# EAGLE board AtoVproject 16n ALPS V1.4 NL (EAGLE 9.5.2)
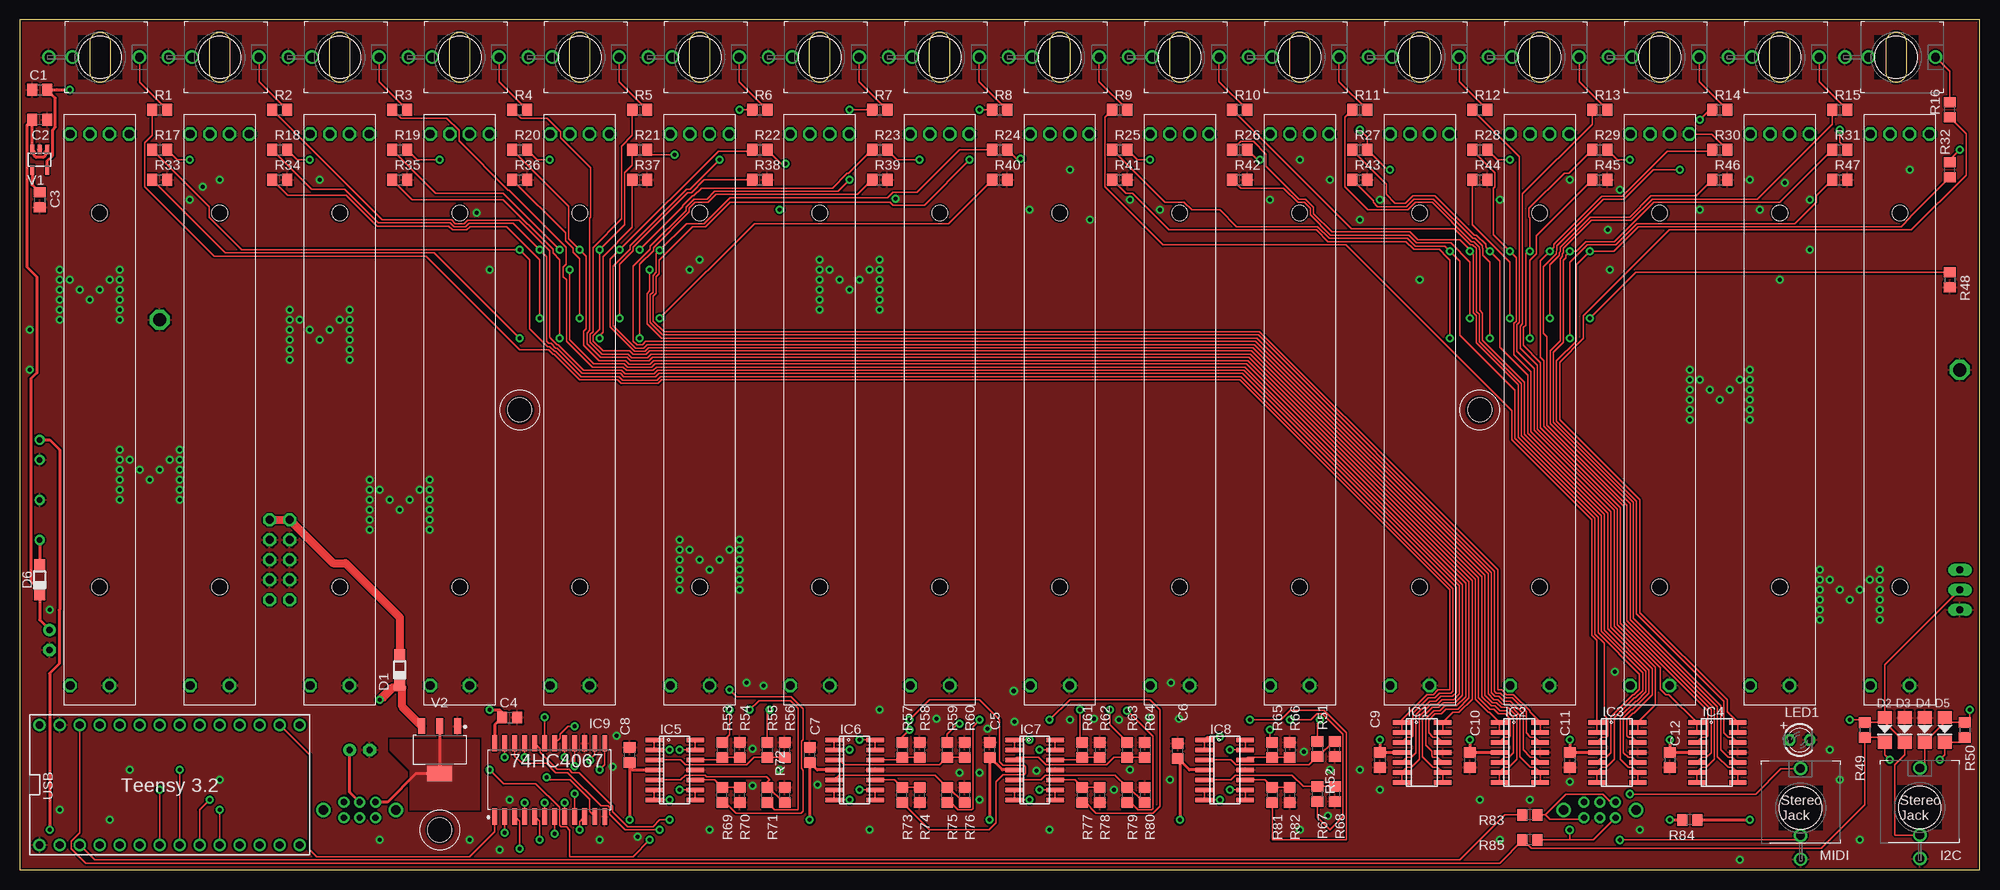
[diagram p2: board, top side]
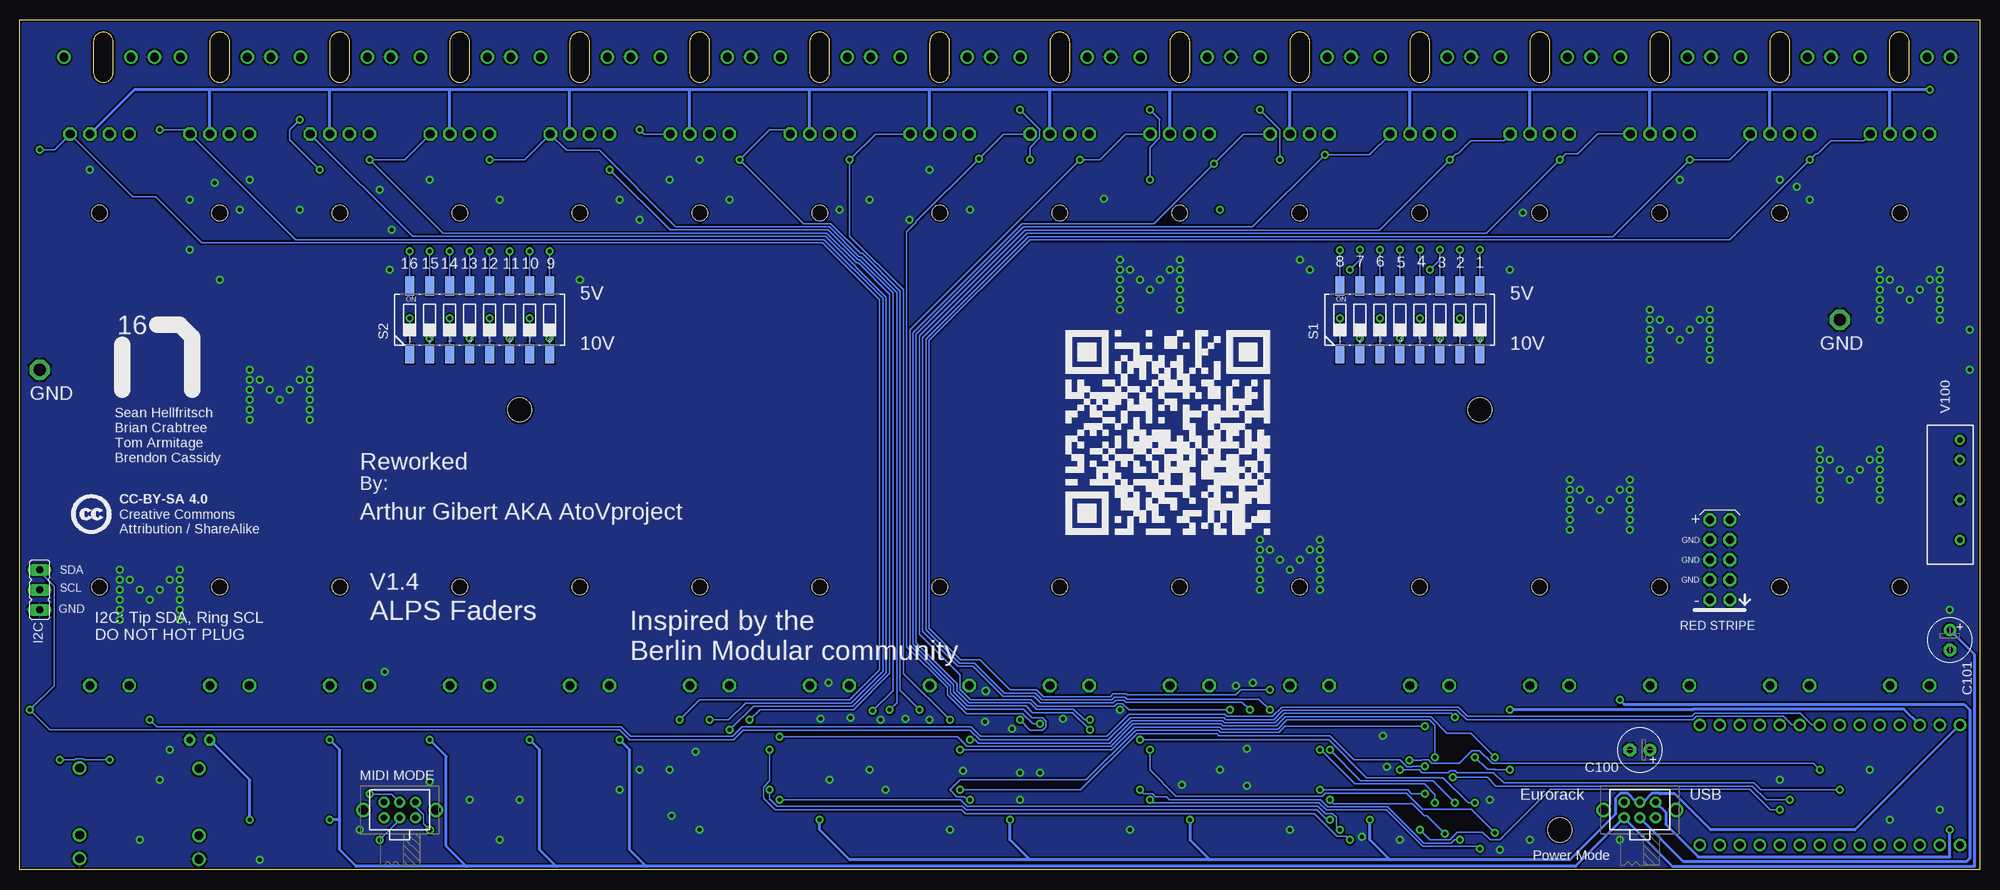
[diagram p3: board, bottom side, seen from below]

Size 248.92 x 107.95 mm. Coordinates in mm from the lower left corner, seen from the top.
Outline: 0,107.95 0,0 248.92,0 248.92,107.95 0,107.95
Copper layers (1*16): Top 0.035mm / dielectric 1.5mm / Bottom 0.035mm
Design rules "SparkFun": minimum track width 8mil, minimum drill 20mil, track to track 8mil, track to pad 8mil, pad to pad 8mil, via to via 8mil, smd to smd 8mil, copper to edge 10mil, drill to drill 8mil, minimum pad ring 12mil, minimum via ring 10mil, stop-mask expansion 4mil, vias tented up to drill 25mil, thermal gap 10mil
Holes 3.1 mm at 63.5,58.42 185.42,58.42 53.34,5.08

## Footprints (pad centres in the part's own frame; a part is rotated, then mirrored left to right if it is on the bottom)
C0805 = smd 1.3 x 1.5: 1 -0.95,0; 2 0.95,0
E2,5-6 = drill 0.813 pad 1.6: + -1.27,0 | drill 0.813 pad 1.6 octagon: - 1.27,0
SOD123 = smd 1.4 x 1.4: A 1.9,0; C -1.9,0
SOD-123 = smd 1.6 x 1.8: A 1.575,0; C -1.575,0
P1-17 = drill 1.702 pad 2.54 octagon: TP 0,0
JP2 = drill 0.914 long: 1 -2.54,0; 2 0,0; 3 2.54,0
SO14 = smd 0.6 x 2.2: 1 -3.81,-2.6; 2 -2.54,-2.6; 3 -1.27,-2.6; 4 0,-2.6; 5 1.27,-2.6; 6 2.54,-2.6; 7 3.81,-2.6; 8 3.81,2.6; 9 2.54,2.6; 10 1.27,2.6; 11 0,2.6; 12 -1.27,2.6; 13 -2.54,2.6; 14 -3.81,2.6
SOIC127P1030X265-24 = smd 2.056 x 0.602: 1 -4.642,6.985; 2 -4.642,5.715; 3 -4.642,4.445; 4 -4.642,3.175; 5 -4.642,1.905; 6 -4.642,0.635; 7 -4.642,-0.635; 8 -4.642,-1.905; 9 -4.642,-3.175; 10 -4.642,-4.445; 11 -4.642,-5.715; 12 -4.642,-6.985; 13 4.642,-6.985; 14 4.642,-5.715; 15 4.642,-4.445; 16 4.642,-3.175; 17 4.642,-1.905; 18 4.642,-0.635; 19 4.642,0.635; 20 4.642,1.905; 21 4.642,3.175; 22 4.642,4.445; 23 4.642,5.715; 24 4.642,6.985
TEENSY_3_AND_LC_SERIES_BOARDS_V1.4_TEENSY_3.0-3.2&LC_DIL = drill 0.965: 0 -7.62,13.97; 1 -7.62,11.43; 2 -7.62,8.89; 3 -7.62,6.35; 3.3V 7.62,11.43; 4 -7.62,3.81; 5 -7.62,1.27; 6 -7.62,-1.27; 7 -7.62,-3.81; 8 -7.62,-6.35; 9 -7.62,-8.89; 10 -7.62,-11.43; 11 -7.62,-13.97; 12 -7.62,-16.51; 13 7.62,-16.51; 14/A0 7.62,-13.97; 15/A1 7.62,-11.43; 16/A2 7.62,-8.89; 17/A3 7.62,-6.35; 18/A4 7.62,-3.81; 19/A5 7.62,-1.27; 20/A6 7.62,1.27; 21/A7 7.62,3.81; 22/A8 7.62,6.35; 23/A9 7.62,8.89; AGND 7.62,13.97; GND -7.62,16.51; VIN 7.62,16.51
WQP-PJ301M-12JACK-BANANA = drill 1.1: P$1_TIP 0,5; P$2_SWITCH 0,-3.5; P$3_SLEEVE 0,-6.5
WQP-PJ366ST_JACK = drill 1.1: P$1_TIP 0,5; P$2_SWITCH 0,-3.5; P$3_SLEEVE 0,-6.5
LED3MM = drill 0.813 octagon: A -1.27,0; K 1.27,0
R0805 = smd 1.3 x 1.5: 1 -0.95,0; 2 0.95,0
CTS-219-08 = smd 1.13 x 2.44: 1 -8.89,-4.3; 2 -6.35,-4.3; 3 -3.81,-4.3; 4 -1.27,-4.3; 5 1.27,-4.3; 6 3.81,-4.3; 7 6.35,-4.3; 8 8.89,-4.3; 9 8.89,4.3; 10 6.35,4.3; 11 3.81,4.3; 12 1.27,4.3; 13 -1.27,4.3; 14 -3.81,4.3; 15 -6.35,4.3; 16 -8.89,4.3
EG2211 = drill 0.8: P1 -1,0; P1-TA -1,2; P1-TB -1,-2; P2 1,0; P2-TA 1,2; P2-TB 1,-2 | drill 1.2: P$7 0,4.6; P$8 0,-4.6
EURO_POWER_HEADER = drill 1.016 octagon: 1 -5.08,-1.27; 2 -5.08,1.27; 3 -2.54,-1.27; 4 -2.54,1.27; 5 0,-1.27; 6 0,1.27; 7 2.54,-1.27; 8 2.54,1.27; 9 5.08,-1.27; 10 5.08,1.27
MONOME_RS6011SP600 = drill 1.1 octagon: 1 -35,1.25; 2 -35,3.75; 3 35,1.25; L1 35,-3.75; L2 -35,-3.75; L3 -35,-1.25 | hole 2: -25,0; 22.5,0
SOT23-5 = smd 0.55 x 1.2: 1 -0.95,-1.3; 2 0,-1.3; 3 0.95,-1.3; 4 0.95,1.3; 5 -0.95,1.3
SOT223 = smd 1.965 x 0.889: GND -3.023,2.3; IN -3.023,-2.3; OUT -3.023,0 | smd 1.965 x 3.189: TAB 3.023,0
TMA = drill 0.7 pad 1.1: 1 -3.81,0; 2 -1.27,0; 3 3.81,0; 4 8.89,0

## Placement (x,y rotation side)
C1  10u  [C0805]  2.54,99.06 0 top
C2  1u  [C0805]  2.54,95.25 180 top
C3  10n  [C0805]  2.54,85.09 270 top
C4  100n  [C0805]  62.23,19.37 0 top
C5  100n  [C0805]  123.19,15.24 90 top
C6  100n  [C0805]  147.06,15.12 90 top
C7  100n  [C0805]  100.33,14.61 90 top
C8  100n  [C0805]  77.47,14.6 90 top
C9  100n  [C0805]  172.72,13.97 270 top
C10  100n  [C0805]  184.15,13.97 270 top
C11  100n  [C0805]  196.85,13.97 270 top
C12  100n  [C0805]  209.55,13.97 270 top
C100  47uf  [E2,5-6]  43.18,15.24 180 bottom
C101  47uf  [E2,5-6]  3.81,29.21 270 bottom
D1  [SOD123]  48.26,25.4 90 top
D2  [SOD-123]  236.86,17.78 90 top
D3  [SOD-123]  239.4,17.78 90 top
D4  [SOD-123]  241.94,17.78 90 top
D5  [SOD-123]  244.48,17.78 90 top
D6  [SOD123]  2.54,36.83 90 top
GND  TPPAD1-17  [P1-17]  17.78,69.85 0 bottom
I2C  [JP2]  246.38,35.56 270 bottom
IC1  NCS2007  [SO14]  178.12,14.92 270 top
IC2  NCS2007  [SO14]  190.5,14.92 270 top
IC3  NCS2007  [SO14]  202.88,14.92 270 top
IC4  NCS2007  [SO14]  215.58,14.92 270 top
IC5  MCP6004_SMD  [SO14]  83.19,12.7 270 top
IC6  MCP6004_SMD  [SO14]  106.05,12.7 270 top
IC7  MCP6004_SMD  [SO14]  128.91,12.7 270 top
IC8  MCP6004_SMD  [SO14]  153.04,12.7 270 top
IC9  CD74HC4067SM96  [SOIC127P1030X265-24]  67.31,11.43 90 top
IC10  TEENSY_3.2_PIN  [TEENSY_3_AND_LC_SERIES_BOARDS_V1.4_TEENSY_3.0-3.2&LC_DIL]  19.05,10.79 90 top
J1  THONKICONN  [WQP-PJ301M-12JACK-BANANA]  10.22,103.19 270 top
J2  THONKICONN  [WQP-PJ301M-12JACK-BANANA]  25.4,103.19 270 top
J3  THONKICONN  [WQP-PJ301M-12JACK-BANANA]  40.64,103.19 270 top
J4  THONKICONN  [WQP-PJ301M-12JACK-BANANA]  55.88,103.19 270 top
J5  THONKICONN  [WQP-PJ301M-12JACK-BANANA]  71.12,103.19 270 top
J6  THONKICONN  [WQP-PJ301M-12JACK-BANANA]  86.36,103.19 270 top
J7  THONKICONN  [WQP-PJ301M-12JACK-BANANA]  101.6,103.19 270 top
J8  THONKICONN  [WQP-PJ301M-12JACK-BANANA]  116.84,103.19 270 top
J9  THONKICONN  [WQP-PJ301M-12JACK-BANANA]  132.08,103.19 270 top
J10  THONKICONN  [WQP-PJ301M-12JACK-BANANA]  147.32,103.19 270 top
J11  THONKICONN  [WQP-PJ301M-12JACK-BANANA]  162.56,103.19 270 top
J12  THONKICONN  [WQP-PJ301M-12JACK-BANANA]  177.8,103.19 270 top
J13  THONKICONN  [WQP-PJ301M-12JACK-BANANA]  193.04,103.19 270 top
J14  THONKICONN  [WQP-PJ301M-12JACK-BANANA]  208.28,103.19 270 top
J15  THONKICONN  [WQP-PJ301M-12JACK-BANANA]  223.52,103.19 270 top
J16  THONKICONN  [WQP-PJ301M-12JACK-BANANA]  238.3,103.19 270 top
JP1  THONKI-STEREO  [WQP-PJ366ST_JACK]  241.3,7.94 0 top
JP2  THONKI-STEREO  [WQP-PJ366ST_JACK]  226.17,7.86 0 top
LED1  LED  [LED3MM]  226.06,16.51 0 top
R1  1K  [R0805]  17.78,96.52 0 top
R2  1K  [R0805]  33.02,96.52 0 top
R3  1K  [R0805]  48.26,96.52 0 top
R4  1K  [R0805]  63.5,96.52 0 top
R5  1K  [R0805]  78.74,96.52 0 top
R6  1K  [R0805]  93.98,96.52 0 top
R7  1K  [R0805]  109.22,96.52 0 top
R8  1K  [R0805]  124.46,96.52 0 top
R9  1K  [R0805]  139.7,96.52 0 top
R10  1K  [R0805]  154.94,96.52 0 top
R11  1K  [R0805]  170.18,96.52 0 top
R12  1K  [R0805]  185.42,96.52 0 top
R13  1K  [R0805]  200.66,96.52 0 top
R14  1K  [R0805]  215.9,96.52 0 top
R15  1K  [R0805]  231.14,96.52 0 top
R16  1K  [R0805]  245.11,96.52 90 top
R17  10K  [R0805]  17.78,91.44 0 top
R18  10K  [R0805]  33.02,91.44 0 top
R19  10K  [R0805]  48.26,91.44 0 top
R20  10K  [R0805]  63.5,91.44 0 top
R21  10K  [R0805]  78.74,91.44 0 top
R22  10K  [R0805]  93.98,91.44 0 top
R23  10K  [R0805]  109.22,91.44 0 top
R24  10K  [R0805]  124.46,91.44 0 top
R25  10K  [R0805]  139.7,91.44 0 top
R26  10K  [R0805]  154.94,91.44 0 top
R27  10K  [R0805]  170.18,91.44 0 top
R28  10K  [R0805]  185.42,91.44 0 top
R29  10K  [R0805]  200.66,91.44 0 top
R30  10K  [R0805]  215.9,91.44 0 top
R31  10K  [R0805]  231.14,91.44 0 top
R32  10K  [R0805]  245.11,88.9 90 top
R33  10K  [R0805]  17.78,87.63 0 top
R34  10K  [R0805]  33.02,87.63 0 top
R35  10K  [R0805]  48.26,87.63 0 top
R36  10K  [R0805]  63.5,87.63 0 top
R37  10K  [R0805]  78.74,87.63 0 top
R38  10K  [R0805]  93.98,87.63 0 top
R39  10K  [R0805]  109.22,87.63 0 top
R40  10K  [R0805]  124.46,87.63 0 top
R41  10K  [R0805]  139.7,87.63 0 top
R42  10K  [R0805]  154.94,87.63 0 top
R43  10K  [R0805]  170.18,87.63 0 top
R44  10K  [R0805]  185.42,87.63 0 top
R45  10K  [R0805]  200.66,87.63 0 top
R46  10K  [R0805]  215.9,87.63 0 top
R47  10K  [R0805]  231.14,87.63 0 top
R48  10K  [R0805]  245.11,74.93 270 top
R49  DNP  [R0805]  234.31,17.78 270 top
R50  DNP  [R0805]  247.02,17.78 270 top
R51  20K  [R0805]  164.78,15.37 270 top
R52  10K  [R0805]  167.01,15.37 90 top
R53  20K  [R0805]  89.22,15.24 270 top
R54  10K  [R0805]  91.44,15.24 270 top
R55  20K  [R0805]  94.93,15.24 270 top
R56  10K  [R0805]  97.16,15.24 270 top
R57  20K  [R0805]  112.08,15.24 270 top
R58  10K  [R0805]  114.3,15.24 270 top
R59  20K  [R0805]  117.79,15.24 270 top
R60  10K  [R0805]  120.02,15.24 270 top
R61  20K  [R0805]  134.94,15.24 270 top
R62  10K  [R0805]  137.16,15.24 270 top
R63  20K  [R0805]  140.65,15.24 270 top
R64  10K  [R0805]  142.88,15.24 270 top
R65  20K  [R0805]  159.07,15.24 270 top
R66  10K  [R0805]  161.29,15.24 270 top
R67  20K  [R0805]  164.78,9.65 90 top
R68  10K  [R0805]  167.01,9.65 90 top
R69  20K  [R0805]  89.22,9.53 90 top
R70  10K  [R0805]  91.44,9.53 90 top
R71  20K  [R0805]  94.93,9.53 90 top
R72  10K  [R0805]  97.16,9.53 270 top
R73  20K  [R0805]  112.08,9.53 90 top
R74  10K  [R0805]  114.3,9.53 90 top
R75  20K  [R0805]  117.79,9.53 90 top
R76  10K  [R0805]  120.02,9.53 270 top
R77  20K  [R0805]  134.94,9.53 90 top
R78  10K  [R0805]  137.16,9.53 90 top
R79  20K  [R0805]  140.65,9.53 90 top
R80  10K  [R0805]  142.88,9.53 270 top
R81  20K  [R0805]  159.07,9.53 90 top
R82  10K  [R0805]  161.29,9.53 90 top
R83  47  [R0805]  191.77,6.99 180 top
R84  10k  [R0805]  212.09,6.35 180 top
R85  47  [R0805]  191.77,3.81 180 top
S1  219-08  [CTS-219-08]  72.39,69.85 0 bottom
S2  219-08  [CTS-219-08]  190.5,69.85 0 bottom
S100  [EG2211]  200.66,7.62 90 bottom
S101  [EG2211]  43.18,7.62 90 bottom
SV100  EURO_POWER_HEADERREGULAR  [EURO_POWER_HEADER]  33.02,39.37 90 bottom
TP100  TPPAD1-17  [P1-17]  246.38,63.5 0 bottom
U$1  SLIDERSALPS-60MM  [MONOME_RS6011SP600]  10.16,58.42 270 top
U$2  SLIDERSALPS-60MM  [MONOME_RS6011SP600]  25.4,58.42 270 top
U$3  SLIDERSALPS-60MM  [MONOME_RS6011SP600]  40.64,58.42 270 top
U$4  SLIDERSALPS-60MM  [MONOME_RS6011SP600]  55.88,58.42 270 top
U$5  SLIDERSALPS-60MM  [MONOME_RS6011SP600]  71.12,58.42 270 top
U$6  SLIDERSALPS-60MM  [MONOME_RS6011SP600]  86.36,58.42 270 top
U$7  SLIDERSALPS-60MM  [MONOME_RS6011SP600]  101.6,58.42 270 top
U$8  SLIDERSALPS-60MM  [MONOME_RS6011SP600]  116.84,58.42 270 top
U$9  SLIDERSALPS-60MM  [MONOME_RS6011SP600]  132.08,58.42 270 top
U$10  SLIDERSALPS-60MM  [MONOME_RS6011SP600]  147.32,58.42 270 top
U$11  SLIDERSALPS-60MM  [MONOME_RS6011SP600]  162.56,58.42 270 top
U$12  SLIDERSALPS-60MM  [MONOME_RS6011SP600]  177.8,58.42 270 top
U$13  SLIDERSALPS-60MM  [MONOME_RS6011SP600]  193.04,58.42 270 top
U$14  SLIDERSALPS-60MM  [MONOME_RS6011SP600]  208.28,58.42 270 top
U$15  SLIDERSALPS-60MM  [MONOME_RS6011SP600]  223.52,58.42 270 top
U$16  SLIDERSALPS-60MM  [MONOME_RS6011SP600]  238.76,58.42 270 top
V1  LP2985M5  [SOT23-5]  2.54,90.17 180 top
V2  LM1117  [SOT223]  53.34,15.24 270 top
V100  DC-ISO  [TMA]  2.54,50.8 270 bottom

## Tracks (layer width: path | path; a pad name or v marks a point on that pad's centre or on a via)
5VREG
  Top 0.406: V2.OUT V2.TAB 50.31,12.22 46.72,8.62 S101.P2-TA
  pour Top (no thermals): 58.42,16.51 46.99,16.51 46.99,15.24 49.53,12.7 49.53,7.62 58.42,7.62 58.42,8.38
5VTOREG  (via drill 0.51)
  Top 0.406: v3.81,5.08 3.81,24.96 5.01,26.17 5.01,33.02 5.08,33.08 5.08,53.34 3.81,54.61 V100.1
  Bottom 0.406: v3.81,5.08 3.81,1.68 35.76,1.68 39.89,5.81 39.89,7.33 S101.P2-TB
12IN
  Top 1.016: SV100.9 SV100.10 39.79,38.95 41.37,38.95 48.26,32.06 D1.A
+3V3  (via drill 0.51)
  Top 0.203: R50.2 246.39,16.2 D5.C 244.48,14.61 v243.84,13.97 | v237.49,13.97 236.86,14.6 D2.C 236.23,16.83 R49.2 234.32,8.26 228.81,2.75 191.94,2.75 190.89,3.81 | R85.2 190.89,3.81 | IC10.3.3V 7.62,4.72 6.53,3.63 6.53,2.72 8.39,0.86 187.94,0.86 190.89,3.81
  Top 0.406: IC9.24 60.33,18.41 C4.1 61.28,20 60.96,20.32 v59.69,20.32
  Bottom 0.203: v237.49,13.97 240.69,13.97 240.82,14.1 241.78,14.1 241.91,13.97 v243.84,13.97
  Bottom 0.406: IC10.3.3V 9.63,20.42 36.39,20.42 36.49,20.32 v59.69,20.32
+5V  (via drill 0.51)
  Top 0.406: IC5.4 77.79,12.7 C8.1 v77.47,6.35 | IC6.4 101.29,12.7 C7.1 v100.33,6.35 | IC7.4 124.78,12.7 C5.1 v123.19,6.35 | IC8.4 148.53,12.7 C6.1 147.32,13.91 v147.32,6.35 | S101.P2 41.91,9.89 C100.+
  Bottom 0.406: 74.93,1.27 52.07,1.27 46.29,7.05 46.29,9.08 45.64,9.73 44.72,9.73 43.61,8.62 S101.P2 42.75,8.62 41.64,9.73 40.72,9.73 40.64,9.65 38.76,9.65 34.19,5.08 15.88,5.08 IC10.VIN | 74.93,1.27 97.79,1.27 | 97.79,1.27 120.65,1.27 | 120.65,1.27 143.51,1.27 147.32,5.08 v147.32,6.35 | 120.65,1.27 123.19,3.81 v123.19,6.35 | v100.33,6.35 100.33,3.81 97.79,1.27 | 74.93,1.27 77.47,3.81 v77.47,6.35
+10V  (via drill 0.51)
  Top 0.406: V1.5 3.49,90.02 4.17,90.7 4.17,93.96 4.54,94.33 4.54,98 C1.2 4.76,99.06 v6.35,99.06
  Bottom 0.406: v6.35,99.06 11.43,99.06 | 11.43,99.06 26.67,99.06 | 26.67,99.06 41.91,99.06 | 41.91,99.06 57.15,99.06 | 57.15,99.06 72.39,99.06 | 72.39,99.06 87.63,99.06 | 87.63,99.06 102.87,99.06 | 102.87,99.06 118.11,99.06 | 118.11,99.06 133.35,99.06 | 133.35,99.06 148.59,99.06 | 148.59,99.06 163.83,99.06 | 163.83,99.06 179.07,99.06 | 179.07,99.06 194.31,99.06 | 194.31,99.06 209.55,99.06 | 209.55,99.06 224.79,99.06 | U$1.1 11.43,93.44 11.43,99.06 | U$2.1 26.67,93.44 26.67,99.06 | U$3.1 41.91,93.44 41.91,99.06 | U$4.1 57.15,93.44 57.15,99.06 | U$5.1 72.39,93.44 72.39,99.06 | U$6.1 87.63,93.44 87.63,99.06 | U$7.1 102.87,93.44 102.87,99.06 | U$8.1 118.11,93.44 118.11,99.06 | U$9.1 133.35,93.44 133.35,99.06 | U$10.1 148.59,93.44 148.59,99.06 | U$11.1 163.83,93.44 163.83,99.06 | U$12.1 179.07,93.44 179.07,99.06 | U$13.1 194.31,93.44 194.31,99.06 | U$14.1 209.55,93.44 209.55,99.06 | U$15.1 224.79,93.44 224.79,99.06 | 224.79,99.06 234.37,99.06 U$16.1
+12V  (via drill 0.51)
  Top 0.406: C9.1 | C9.1 IC1.4 | IC4.4 C12.1 v209.55,16.51 | v172.72,16.51 C9.1 | v184.15,16.51 v184.15,16.5 C10.1 | v196.85,16.51 C11.1 IC3.4 | C10.1 | C10.1 IC2.4 | V1.1 3.22,91.2 3.22,90.7 2.98,90.46 2.1,90.46 1.86,90.7 1.86,91.2 V1.3 C2.2 0.91,94.57 0.91,76.56 2.18,75.29 2.18,63.12 1.43,62.37 1.43,36.67 2.54,35.56 D6.C 2.54,31.75 C101.+ | v209.55,6.35 R84.2
  Bottom 0.406: 169.36,0.46 171.45,2.54 171.45,15.24 v172.72,16.51 | 169.36,0.46 51.34,0.46 S101.P1-TA 39.02,0.46 0.66,0.46 0.66,27.33 C101.+ | 169.36,0.46 180.79,0.46 | 180.79,0.46 182.88,2.54 182.88,15.24 v184.15,16.51 | 180.79,0.46 192.22,0.46 | 192.22,0.46 206.19,0.46 208.28,2.54 208.28,6.35 | v209.55,16.51 208.28,15.24 208.28,6.35 | 192.22,0.46 194.75,2.98 194.75,14.41 v196.85,16.51 | 208.28,6.35 v209.55,6.35
A0  (via drill 0.51)
  Top 0.203: IC5.8 IC5.9 v83.82,10.16 | IC9.9 v70.49,9.7
  Bottom 0.203: v70.49,9.7 72.17,9.7 72.63,10.16 v83.82,10.16
A1  (via drill 0.51)
  Top 0.203: IC5.14 IC5.13 v83.82,15.24 | IC9.8 v69.22,8.53
  Bottom 0.203: v83.82,15.24 83.7,15.24 79.38,10.92 70.56,10.92 69.22,9.58 v69.22,8.53
A2  (via drill 0.51)
  Top 0.203: IC5.6 IC5.7 v82.55,8.89 | IC9.7 v67.95,4.62
  Bottom 0.203: v82.55,8.89 82.09,8.43 72.05,8.43 70.52,6.9 70.23,6.9 v67.95,4.62
A3  (via drill 0.51)
  Top 0.203: IC5.1 IC5.2 v82.55,15.24 | IC9.6 v66.68,8.53
  Bottom 0.203: v82.55,15.24 78.64,11.33 69.48,11.33 v66.68,8.53
A4  (via drill 0.51)
  Top 0.203: IC6.8 IC6.9 v106.68,10.16 | v66.04,3.81 66.04,6.16 IC9.5
  Bottom 0.203: v66.04,3.81 66.73,3.81 67.15,3.4 70.58,3.4 75.21,8.03 82.83,8.03 83.75,8.94 102.92,8.94 103.27,9.3 104.66,9.3 105.07,9.7 106.22,9.7 v106.68,10.16
A5  (via drill 0.51)
  Top 0.203: IC6.13 IC6.14 v106.68,16.51 | IC9.4 v64.14,8.53
  Bottom 0.203: v64.14,8.53 64.95,8.53 68.16,11.73 77.89,11.73 82.67,16.51 v106.68,16.51
A6  (via drill 0.51)
  Top 0.203: IC6.6 IC6.7 v105.41,8.89 | v63.5,2.72 63.5,6.16 IC9.3
  Bottom 0.203: v63.5,2.72 63.77,2.99 70.75,2.99 75.38,7.62 83,7.62 83.92,8.53 105.05,8.53 v105.41,8.89
A7  (via drill 0.51)
  Top 0.203: IC6.1 IC6.2 v105.41,15.24 | IC9.2 v61.6,4.72
  Bottom 0.203: v61.6,4.72 64.59,7.71 70.76,7.71 72.8,9.75 83.07,9.75 83.48,9.35 102.05,9.35 105.41,12.7 v105.41,15.24
A8  (via drill 0.51)
  Top 0.203: IC7.8 IC7.9 v129.54,10.16 | IC9.16 v70.49,13.16
  Bottom 0.203: v70.49,13.16 72.04,13.16 72.08,13.13 72.75,13.13 73.62,14 79.48,14 82.55,17.07 96.59,17.07 96.85,17.32 107.01,17.32 114.18,10.16 v129.54,10.16
A9  (via drill 0.51)
  Top 0.203: IC7.14 IC7.13 v129.54,15.24 | IC9.17 v69.22,14.33
  Bottom 0.203: v69.22,14.33 69.22,18.36 69.91,19.06 87.98,19.06 89.16,17.88 96.26,17.88 96.51,18.14 107.35,18.14 110.25,15.24 v129.54,15.24
A10  (via drill 0.51)
  Top 0.203: IC7.6 IC7.7 v128.27,8.89 | IC9.18 68.61,16.74 68.61,17.23 69.63,18.24 v70.49,18.24
  Bottom 0.203: v128.27,8.89 128.51,8.89 128.91,9.3 129.94,9.3 130.81,10.16 129.54,11.43 113.48,11.43 107.18,17.73 96.68,17.73 96.43,17.48 88.99,17.48 88.22,18.24 v70.49,18.24
A11  (via drill 0.51)
  Top 0.203: IC7.2 IC7.1 v128.27,16.51 | IC9.19 v66.68,19.41
  Bottom 0.203: v128.27,16.51 127.57,16.51 127.17,16.1 110.53,16.1 107.69,18.95 96.17,18.95 95.92,18.69 89.49,18.69 88.32,19.87 67.13,19.87 v66.68,19.41
A12  (via drill 0.51)
  Top 0.203: IC8.8 IC8.9 v153.67,10.16 | IC9.20 66.07,15.41 66.07,14.92 68.23,12.76 69.74,12.76 70.15,12.35 71.07,12.35 75.31,8.11 75.31,7.36 77.18,5.49 80.41,5.49 81.28,6.35 v82.55,6.35
  Bottom 0.203: v153.67,10.16 153.67,8.89 153.55,8.89 152.73,8.08 129.18,8.08 128.77,7.67 128.32,7.67 128.27,7.62 84.15,7.62 82.88,6.35 v82.55,6.35
A13  (via drill 0.51)
  Top 0.203: IC8.14 IC8.13 v153.67,15.24 | IC9.21 v64.14,14.33 | v59.69,12.7 61.44,10.94 65.55,10.94 68.55,7.94 68.55,5.69 68.79,5.46 69.45,5.46 69.85,5.05 69.85,1.68 77.87,1.68 v80.01,3.81
  Bottom 0.203: v153.67,15.24 153.67,11.31 154.48,10.5 154.48,9.13 152.97,7.62 129.3,7.62 128.84,7.16 84.51,7.16 81.61,4.27 80.46,4.27 v80.01,3.81 | v59.69,12.7 61.53,12.7 61.59,12.76 62.56,12.76 v64.14,14.33
A14  (via drill 0.51)
  Top 0.203: IC8.6 IC8.7 v152.4,8.89 | v81.28,5.08 76.89,5.08 74.9,7.07 74.9,7.94 74.72,8.12 73.8,8.12 69.57,12.35 68.06,12.35 66.89,13.52 63.8,13.52 62.87,14.45 IC9.22
  Bottom 0.203: v152.4,8.89 129.42,8.89 128.6,8.08 84.03,8.08 83.12,7.16 82.21,7.16 81.73,6.69 81.73,5.54 v81.28,5.08
A15  (via drill 0.51)
  Top 0.203: IC8.2 IC8.1 150.82,16.89 v152.4,16.89 | IC9.23 v61.6,14.33
  Bottom 0.203: v152.4,16.89 129.8,16.89 128.6,15.7 110.36,15.7 107.52,18.54 96.34,18.54 96.09,18.29 89.33,18.29 88.15,19.46 69.74,19.46 67.65,17.37 64.64,17.37 v61.6,14.33
ANALOG_IN
  Top 0.203: IC10.14/A0 36.83,14.61 36.83,2.54 37.69,1.68 57.15,1.68 60.33,4.85 IC9.1
CV1
  Top 0.203: J1.P$1_TIP 15.22,100.03 R1.2
CV2
  Top 0.203: J2.P$1_TIP 30.4,100.09 R2.2
CV3
  Top 0.203: J3.P$1_TIP 45.64,100.09 R3.2
CV4
  Top 0.203: J4.P$1_TIP 60.88,100.09 R4.2
CV5
  Top 0.203: J5.P$1_TIP 76.12,100.09 R5.2
CV6
  Top 0.203: J6.P$1_TIP 91.36,100.09 R6.2
CV7
  Top 0.203: J7.P$1_TIP 106.6,100.09 R7.2
CV8
  Top 0.203: R8.2 121.84,100.09 J8.P$1_TIP
CV9
  Top 0.203: J9.P$1_TIP 137.08,100.09 R9.2
CV10
  Top 0.203: J10.P$1_TIP 152.32,100.09 R10.2
CV11
  Top 0.203: J11.P$1_TIP 167.56,100.09 R11.2
CV12
  Top 0.203: J12.P$1_TIP 182.8,100.09 R12.2
CV13
  Top 0.203: J13.P$1_TIP 198.04,100.09 R13.2
CV14
  Top 0.203: J14.P$1_TIP 213.28,100.09 R14.2
CV15
  Top 0.203: J15.P$1_TIP 228.52,100.09 R15.2
CV16
  Top 0.203: J16.P$1_TIP 245.11,101.38 R16.2
EURO12  (via drill 0.51)
  Top 0.406: 48.58,23.18 D1.C 46.35,21.59 v45.72,21.59
  Top 1.016: V2.IN 48.58,20.72 48.58,23.18 47.31,23.18 v45.72,21.59
  Bottom 0.406: S101.P1 37.63,1.07 1.68,1.07 1.27,1.48 1.27,20.32 1.98,21.03 45.16,21.03 v45.72,21.59
GND  (via drill 0.51, 0.55)
  other vias: 166.37,12.7 170.18,12.7 172.72,10.16 162.56,5.08 166.11,6.86 163.07,14.99 185.42,8.89 191.77,8.89 205.74,5.08 196.85,11.18 229.87,15.24 231.14,11.43 233.68,3.81 218.44,1.27 75.31,13.08 87.63,5.08 73.66,3.81 57.15,3.81 96.52,12.7 101.34,10.79 109.22,20.32 116.46,19.18 122.93,17.91 126.36,18.8 119.38,12.32 121.92,12.32 129.16,12.57 140.97,12.7 138.94,10.16 146.05,11.43 133.35,19.05 111.25,85.22 128.27,83.82 133.35,88.9 144.78,83.82 158.75,85.09 162.56,90.17 172.72,85.09 25.4,87.63 93.09,10.67 93.09,15.37 187.96,85.09 203.2,86.36 219.71,87.63 139.57,19.05 143.38,19.3 146.17,23.75 147.19,19.18 136.4,19.18 107.95,5.08 130.81,5.08 25.4,11.43 45.72,3.81 62.23,8.89 121.92,8.89 223.52,74.93 227.33,85.09 227.33,78.74 212.09,57.15 212.09,58.42 212.09,59.69 212.09,60.96 212.09,62.23 214.63,60.96 215.9,59.69 217.17,60.96 219.71,60.96 219.71,62.23 219.71,59.69 219.71,58.42 219.71,57.15 34.29,64.77 34.29,66.04 34.29,67.31 34.29,68.58 34.29,69.85 34.29,71.12 35.56,69.85 36.83,68.58 38.1,67.31 39.37,68.58 40.64,69.85 41.91,71.12 41.91,69.85 41.91,68.58 41.91,67.31 41.91,64.77 41.91,66.04 5.08,69.85 5.08,71.12 5.08,72.39 5.08,73.66 5.08,74.93 5.08,76.2 6.35,74.93 7.62,73.66 8.89,72.39 10.16,73.66 11.43,74.93 12.7,76.2 12.7,74.93 12.7,73.66 12.7,72.39 12.7,69.85 12.7,71.12 12.7,46.99 12.7,48.26 12.7,49.53 12.7,50.8 12.7,52.07 12.7,53.34 13.97,52.07 15.24,50.8 16.51,49.53 17.78,50.8 19.05,52.07 20.32,53.34 20.32,52.07 20.32,50.8 20.32,49.53 20.32,46.99 20.32,48.26 44.45,43.18 44.45,44.45 44.45,45.72 44.45,46.99 44.45,48.26 44.45,49.53 45.72,48.26 46.99,46.99 48.26,45.72 49.53,46.99 50.8,48.26 52.07,49.53 52.07,48.26 52.07,46.99 52.07,45.72 52.07,43.18 52.07,44.45 83.82,35.56 83.82,36.83 83.82,38.1 83.82,39.37 83.82,40.64 83.82,41.91 85.09,40.64 86.36,39.37 88.9,39.37 90.17,40.64 91.44,41.91 91.44,40.64 91.44,39.37 91.44,38.1 91.44,35.56 91.44,36.83 228.6,31.75 228.6,33.02 228.6,34.29 228.6,35.56 228.6,36.83 228.6,38.1 229.87,36.83 231.14,35.56 232.41,34.29 233.68,35.56 234.95,36.83 236.22,38.1 236.22,36.83 236.22,35.56 236.22,34.29 236.22,31.75 236.22,33.02 213.36,62.23 212.09,63.5 218.44,62.23 219.71,63.5 196.85,87.63 240.03,88.9 166.37,87.63 140.97,85.09 135.89,82.55 187.96,3.81 94.49,23.37 92.33,23.75 75.82,17.02 13.97,12.7 11.43,6.35 5.08,7.62 78.48,4.19 60.96,2.54 1.27,68.58 1.27,63.5 170.18,82.55 21.59,85.09 23.24,86.74 59.69,76.2 86.36,77.47 85.09,76.2 177.8,74.93 201.93,76.2 87.63,38.1 126.24,22.73 38.1,87.63 58.04,83.44 224.15,87.25 201.67,81.28 202.56,25.15 213.36,83.82 220.98,83.82 3.81,33.02 101.6,71.12 101.6,72.39 101.6,73.66 101.6,74.93 101.6,76.2 101.6,77.47 102.87,76.2 104.14,74.93 105.41,73.66 106.68,74.93 107.95,76.2 109.22,77.47 109.22,76.2 109.22,74.93 109.22,73.66 109.22,71.12 109.22,72.39
  pour Top (rank 2): -2.54,116.84 264.16,116.84 264.16,-10.16 -2.54,-10.16
  pour Bottom: -1.27,123.19 257.81,123.19 257.81,-5.08 -1.27,-5.08
MIDI_OUT
  Top 0.203: IC10.1 9.53,1.27 182.88,1.27 188.6,6.99 R83.2
N$1  (via drill 0.55)
  Top 0.203: JP2.P$1_TIP 223.68,12.86 220.45,9.63 v204.47,9.63
  Bottom 0.203: S100.P2 201.67,9.63 v204.47,9.63
N$2  (via drill 0.55)
  Top 0.203: JP2.P$2_SWITCH 226.06,4.36 225.51,3.81 v203.2,3.81
  Bottom 0.203: v203.2,3.81 200.66,6.35 S100.P1
N$3
  Top 0.203: S100.P2-TA 202.09,8.62 201.08,9.63 196.36,9.63 193.72,6.99 | 193.72,6.99 R83.1 | 193.72,6.99 194.29,6.41 198.45,6.41 S100.P1-TB
N$4  (via drill 0.55)
  Top 0.203: R85.1 196.85,3.81 | 196.85,3.81 199.85,3.81 S100.P1-TA | 196.85,3.81 v196.85,5.08
  Bottom 0.203: v196.85,5.08 197.65,5.88 197.65,7.04 198.66,8.05 S100.P2-TB
N$5  (via drill 0.51)
  Top 0.203: R17.1 24.04,84.23 24.04,82.86 28.16,78.74 v63.5,78.74 64.77,77.47 64.77,68.7 67.02,66.45 67.31,66.45 67.9,65.86 68.07,65.86 71.29,62.64 76.11,62.64 76.55,62.2 80.93,62.2 81.36,62.64 155.11,62.64 182.01,35.73 182.01,22.69 181.78,22.45 180.3,22.45 179.7,21.85 178.9,21.85 176.92,19.88 176.92,17.04 176.74,16.86 176.18,16.86 IC1.3
  Bottom 0.203: S1.9 v63.5,78.74
N$6
  Top 0.203: IC5.5 83.95,11.43 84.56,12.04 87.01,12.04 87.21,11.84 94.84,11.84 95.25,11.43 94.93,11.12 R71.2 R72.2
N$7
  Top 0.203: IC5.3 83.95,13.97 84.59,13.34 92.32,13.34 93.27,14.29 R55.2 R56.2
N$8  (via drill 0.51)
  Top 0.203: v63.5,67.48 52.65,78.33 26.13,78.33 R33.1
  Bottom 0.203: S1.8 v63.5,67.48
N$9
  Top 0.203: IC5.10 88.26,11.43 R69.2 R70.2
N$10
  Top 0.203: IC5.12 88.9,13.97 R53.2 R54.2
N$11  (via drill 0.51)
  Top 0.203: IC1.5 176.18,14.32 176.74,14.32 177.33,14.9 177.33,19.71 179.06,21.45 179.87,21.45 180.47,22.05 181.94,22.05 182.42,22.52 182.42,35.9 155.27,63.04 81.2,63.04 80.76,62.6 76.72,62.6 76.28,63.04 71.45,63.04 68.23,66.26 68.07,66.26 67.48,66.85 67.19,66.85 66.9,67.14 66.9,77.88 v66.04,78.74 62.68,82.09 57.04,82.09 56.61,81.66 55.15,81.66 54.66,82.14 45.55,82.14 41.28,86.41 37.1,86.41 R18.1
  Bottom 0.203: v66.04,78.74 S1.10
N$12
  Top 0.203: IC6.10 111.12,11.43 R73.2 R74.2
N$13
  Top 0.203: IC6.12 111.76,13.97 R57.2 R58.2
N$14  (via drill 0.51)
  Top 0.203: R34.1 34.04,85.66 41.46,85.66 45.38,81.74 54.5,81.74 54.98,81.25 56.78,81.25 57.21,81.69 61.82,81.69 66.04,77.47 v66.04,70.02
  Bottom 0.203: S1.7 v66.04,70.02
N$15
  Top 0.203: IC6.5 104.05,12.04 116.23,12.04 R75.2 R76.2
N$16
  Top 0.203: IC6.3 104.14,13.97 104.77,13.34 116.84,13.34 R59.2 | R59.2 | R60.2 R59.2
N$17  (via drill 0.51)
  Top 0.203: IC1.10 180.05,14.32 179.49,14.32 179.31,14.5 179.31,15.06 178.55,15.82 178.55,19.21 179.57,20.23 180.37,20.23 180.97,20.83 182.45,20.83 183.64,22.02 183.64,36.4 155.78,64.26 80.69,64.26 80.25,63.82 77.22,63.82 76.78,64.26 72.9,64.26 69.85,67.31 v69.85,76.2 | R19.1 52.85,85.9 61.41,85.9 v68.58,78.74
  Bottom 0.203: S1.11 v68.58,78.74 68.58,77.47 v69.85,76.2
N$18
  Top 0.203: IC7.10 133.98,11.43 R77.2 R78.2
N$19
  Top 0.203: IC7.12 134.62,13.97 R61.2 R62.2
N$20  (via drill 0.51)
  Top 0.203: v68.58,67.48 68.58,77.47 67.71,78.33 67.71,78.79 61.41,85.09 49.85,85.09 R35.1
  Bottom 0.203: S1.6 v68.58,67.48
N$21
  Top 0.203: IC7.5 129.67,11.43 130.28,12.04 139.09,12.04 R79.2 R80.2
N$22
  Top 0.203: IC7.3 126.63,14.29 129.35,14.29 130.31,13.34 138.04,13.34 138.99,14.29 R63.2 R64.2
N$23  (via drill 0.51)
  Top 0.203: IC1.12 180.05,16.86 179.49,16.86 178.95,17.39 178.95,19.04 179.74,19.82 180.54,19.82 181.14,20.42 182.62,20.42 184.05,21.85 184.05,36.57 155.95,64.67 80.52,64.67 80.08,64.23 77.39,64.23 76.95,64.67 73.6,64.67 71.63,66.64 71.63,68.39 71.93,68.7 71.93,77.93 v71.12,78.74 69.7,80.15 69.7,84.29 R20.1
  Bottom 0.203: v71.12,78.74 S1.12
N$24
  Top 0.203: IC8.3 153.8,13.97 154.44,13.34 163.7,13.34 R51.2 R52.2
N$25
  Top 0.203: IC8.10 158.11,11.43 R81.2 R82.2
N$26  (via drill 0.51)
  Top 0.203: R36.1 69.3,80.88 69.3,79.86 70.25,78.91 70.25,78.45 71.12,77.59 v71.12,70.02
  Bottom 0.203: S1.5 v71.12,70.02
N$27
  Top 0.203: IC8.5 153.8,11.43 154.41,12.04 161.56,12.04 162.99,10.6 R67.2 R68.2
N$28  (via drill 0.51)
  Top 0.406: R84.1 v219.71,6.35
  Bottom 0.406: v219.71,6.35 219.71,11.43 LED1.A
N$29  (via drill 0.51)
  Top 0.203: R21.1 77.79,89.46 76.84,88.51 76.84,81.92 v73.66,78.74 73.66,68.63 72.84,67.82 72.84,67.14 74.1,65.89 77.46,65.89 77.9,65.45 79.58,65.45 80.02,65.89 156.45,65.89 185.27,37.08 185.27,21.85 186.69,20.42 187.2,20.42 187.8,19.82 188.64,19.82 189.3,19.16 189.3,17.04 189.13,16.86 188.57,16.86 IC2.3
  Bottom 0.203: v73.66,78.74 S1.13
N$30  (via drill 0.51)
  Top 0.203: R37.1 77.79,81.6 74.06,77.88 74.06,68.25 73.66,67.84 v73.66,67.48
  Bottom 0.203: S1.4 v73.66,67.48
N$31  (via drill 0.51)
  Top 0.203: R22.1 92.87,91.28 88.74,91.28 v76.2,78.74 74.98,77.52 74.98,68.94 78.06,65.86 79.41,65.86 79.85,66.29 156.62,66.29 185.67,37.24 185.67,22.02 186.86,20.83 187.37,20.83 187.97,20.23 188.81,20.23 189.71,19.33 189.71,14.9 189.13,14.32 188.57,14.32 IC2.5
  Bottom 0.203: v76.2,78.74 S1.14
N$32  (via drill 0.51)
  Top 0.203: R38.1 86.93,87.63 85.3,86 84.84,86 77.92,79.08 77.92,78.62 76.2,76.89 v76.2,70.02
  Bottom 0.203: S1.3 v76.2,70.02
N$33  (via drill 0.51)
  Top 0.203: v78.74,78.74 84.19,84.19 84.19,84.32 85.46,85.59 85.59,85.59 86.57,86.58 103.2,86.58 105.07,88.44 105.27,88.44 R23.1 | IC2.10 192.43,14.32 191.87,14.32 190.93,15.26 190.93,19.83 189.31,21.45 188.47,21.45 187.87,22.05 187.37,22.05 186.89,22.52 186.89,37.75 157.13,67.51 81.49,67.51 79.65,69.35 79.65,73.18 80.01,73.54 v80.01,76.2
  Bottom 0.203: S1.15 v78.74,78.74 78.74,77.47 v80.01,76.2
N$34  (via drill 0.51)
  Top 0.203: v78.74,67.48 78.74,76.89 80.48,78.63 80.48,79.03 85,83.55 85,83.98 85.8,84.78 87.43,84.78 88.42,85.76 106.4,85.76 R39.1
  Bottom 0.203: S1.2 v78.74,67.48
N$35  (via drill 0.51)
  Top 0.203: R24.1 119.38,91.44 113.97,86.03 110.91,86.03 110.24,85.36 90.21,85.36 86.92,82.06 84.66,82.06 v81.29,78.69 80.82,78.22 80.82,75.86 80.41,75.46 80.41,73.37 80.06,73.02 80.06,69.52 81.65,67.92 157.29,67.92 187.3,37.92 187.3,22.69 187.54,22.45 188.04,22.45 188.64,21.85 189.54,21.85 191.34,20.05 191.34,17.39 191.87,16.86 192.43,16.86 IC2.12
  Bottom 0.203: S1.16 81.28,78.68 v81.29,78.69
N$36  (via drill 0.51)
  Top 0.203: R40.1 117.94,82.06 93.32,82.06 v81.28,70.02
  Bottom 0.203: S1.1 v81.28,70.02
N$37  (via drill 0.51)
  Top 0.203: R25.1 145.41,84.78 147.88,84.78 148.84,83.82 152.4,83.82 154.53,81.69 164.81,81.69 166.31,80.19 176.23,80.19 177.22,79.2 180.98,79.2 181.52,78.65 v181.61,78.57 182.88,77.3 182.88,67.89 189.89,60.87 189.89,54.79 200.05,44.63 200.05,29.94 201.23,28.77 201.23,19.62 | IC3.3 200.95,16.86 201.51,16.86 201.69,17.04 201.69,19.16 201.23,19.62 | 201.23,19.62
  Bottom 0.203: S2.9 v181.61,78.57
N$38  (via drill 0.51)
  Top 0.203: R41.1 140.48,85.9 141.3,85.9 145.93,81.28 164.64,81.28 166.14,79.78 176.06,79.78 177.05,78.79 180.29,78.79 180.79,78.28 180.79,78.23 181.61,77.42 v181.61,67.48
  Bottom 0.203: S2.8 v181.61,67.48
N$39  (via drill 0.51)
  Top 0.203: R26.1 154.06,91.44 155.11,92.5 156.67,92.5 158.29,90.87 158.29,89.36 162.47,85.18 163.29,85.18 164.32,84.15 164.32,83.33 166.65,81 176.57,81 177.56,80.01 182.88,80.01 184.15,78.74 v184.15,78.57 184.6,78.11 184.6,70.71 184.96,70.36 184.96,66.91 190.29,61.58 190.29,54.96 200.45,44.8 200.45,30.11 205.69,24.88 205.69,22.94 205.01,22.26 204.88,22.26 202.09,19.47 202.09,14.9 201.51,14.32 200.95,14.32 IC3.5
  Bottom 0.203: S2.10 v184.15,78.57
N$40  (via drill 0.51)
  Top 0.203: R42.1 154.06,87.63 155.11,86.58 160.5,86.58 162.3,84.78 163.12,84.78 163.92,83.98 163.92,83.16 166.48,80.59 176.4,80.59 177.39,79.6 181.72,79.6 184.15,77.18 v184.15,70.02
  Bottom 0.203: S2.7 v184.15,70.02
N$41  (via drill 0.51)
  Top 0.203: R27.1 169.23,91.36 173.53,87.06 173.53,85.77 174.67,84.63 175.95,84.63 176.9,85.59 179.72,85.59 184.71,80.6 184.99,80.6 186.18,79.41 186.18,79.13 186.23,79.08 186.23,79.03 v186.69,78.57 187.96,77.3 187.96,66.39 191.51,62.83 191.51,55.47 201.67,45.31 201.67,30.62 206.91,25.38 206.91,22.43 204.79,20.32 204.66,20.32 203.67,19.33 203.67,14.9 204.26,14.32 204.82,14.32 IC3.10
  Bottom 0.203: S2.11 v186.69,78.57
N$42  (via drill 0.51)
  Top 0.203: R43.1 171.9,84.95 171.9,84.75 172.43,84.23 176.11,84.23 177.07,85.18 179.55,85.18 184.54,80.19 184.82,80.19 185.77,79.24 185.77,78.96 185.82,78.91 185.82,78.04 186.69,77.18 v186.69,67.48
  Bottom 0.203: S2.6 v186.69,67.48
N$43  (via drill 0.51)
  Top 0.203: R28.1 184.47,91.36 187.32,88.51 187.32,86.75 187.14,86.57 187.14,80.65 v189.23,78.57 190.04,77.76 190.04,69.69 189.74,69.38 189.74,65.42 191.92,63.24 191.92,55.63 202.08,45.48 202.08,30.79 207.32,25.55 207.32,22.27 204.96,19.91 204.83,19.91 204.08,19.16 204.08,17.04 204.26,16.86 204.82,16.86 IC3.12
  Bottom 0.203: S2.12 v189.23,78.57
N$44  (via drill 0.51)
  Top 0.203: R44.1 184.47,81.94 189.23,77.18 v189.23,70.02
  Bottom 0.203: S2.5 v189.23,70.02
N$45  (via drill 0.51)
  Top 0.203: R29.1 196.71,88.44 196.15,88.44 191.68,83.98 191.68,82.86 191.77,82.78 191.77,78.74 | 191.77,78.74 v191.77,78.57 | IC4.3 213.65,16.86 214.21,16.86 214.39,17.04 214.39,20.2 203.3,31.29 203.3,45.98 193.14,56.14 193.14,64.42 190.95,66.61 190.95,68.88 191.26,69.18 191.26,78.23 191.77,78.74
  Bottom 0.203: S2.13 v191.77,78.57
N$46  (via drill 0.51)
  Top 0.203: v191.77,67.48 191.77,77.42 192.58,78.23 192.58,80.5 R45.1
  Bottom 0.203: S2.4 v191.77,67.48
N$47  (via drill 0.51)
  Top 0.203: IC4.5 213.65,14.32 214.21,14.32 214.79,14.9 214.79,20.37 203.71,31.46 203.71,46.15 193.55,56.31 193.55,64.62 193.09,65.08 193.09,77.35 v194.31,78.57 194.82,79.08 194.82,79.41 200.95,85.55 203.53,85.55 209.27,91.28 214.79,91.28 R30.1
  Bottom 0.203: S2.14 v194.31,78.57
N$48  (via drill 0.51)
  Top 0.203: v194.31,70.02 194.31,76.84 195.53,78.06 195.53,78.4 195.63,78.5 195.63,79.07 199.43,82.88 204.46,82.88 207.17,85.59 212.91,85.59 R46.1
  Bottom 0.203: S2.3 v194.31,70.02
N$49  (via drill 0.51)
  Top 0.203: IC4.10 217.52,14.32 216.96,14.32 216.01,15.26 216.01,20.88 204.92,31.96 204.92,46.65 194.76,56.81 194.76,65.73 196.03,67 196.03,77.42 196.34,77.73 196.34,78.06 v196.85,78.57 197.66,78.57 198.88,79.79 202.52,79.79 207.51,84.78 223.53,84.78 R31.1
  Bottom 0.203: S2.15 v196.85,78.57
N$50  (via drill 0.51)
  Top 0.203: R47.1 228.14,85.58 228.14,84.75 225.45,82.06 205.37,82.06 202.69,79.38 199.05,79.38 196.85,77.18 v196.85,67.48
  Bottom 0.203: S2.2 v196.85,67.48
N$51  (via drill 0.51)
  Top 0.203: IC4.12 217.52,16.86 216.96,16.86 216.42,17.39 216.42,21.42 205.33,32.51 205.33,46.82 195.17,56.98 195.17,64.66 197.66,67.14 197.66,76.84 v199.39,78.57 202.45,78.57 205.54,81.66 238.92,81.66 240.12,82.86 240.12,82.96 R32.1
  Bottom 0.203: S2.16 v199.39,78.57
N$52  (via drill 0.51)
  Top 0.203: v199.39,70.02 205.25,75.88 R48.1
  Bottom 0.203: S2.1 v199.39,70.02
N$53
  Top 0.406: V100.4 D6.A
N$54
  Top 0.406: V1.4 1.59,86.98 C3.1
N$55
  Top 0.203: IC4.8 IC4.9 217.52,13.05 216.96,13.05 215.61,14.4 215.61,20.71 204.52,31.8 204.52,46.48 194.36,56.65 194.36,65.9 195.63,67.17 195.63,77.59 195.93,77.89 195.93,78.23 196.03,78.33 196.03,78.91 199.6,82.47 204.63,82.47 207.34,85.18 220.67,85.18 230.19,94.7 R15.1
N$58  (via drill 0.51)
  other vias: 96.52,83.82
N$300
  Top 0.203: IC1.2 IC1.1 175.52,19.05 178.73,22.26 179.53,22.26 180.13,22.86 181.61,22.86 181.61,35.56 154.94,62.23 81.53,62.23 81.09,61.79 76.38,61.79 75.94,62.23 71.12,62.23 67.9,65.45 67.74,65.45 67.15,66.04 63.5,66.04 51.61,77.93 24.7,77.93 15.88,86.75 15.88,92.32 16.83,93.27 R1.1
N$301
  Top 0.203: IC1.7 IC1.6 176.18,13.05 176.74,13.05 177.74,14.04 177.74,19.54 179.23,21.04 180.04,21.04 180.63,21.64 182.11,21.64 182.83,22.36 182.83,36.06 155.44,63.45 81.03,63.45 80.59,63.01 76.89,63.01 76.45,63.45 71.62,63.45 68.4,66.67 68.24,66.67 67.31,67.6 67.31,78.62 63.43,82.5 56.88,82.5 56.44,82.06 55.32,82.06 54.83,82.55 46.04,82.55 R2.1
N$302
  Top 0.203: IC1.8 IC1.9 180.05,13.05 179.49,13.05 178.14,14.4 178.14,19.38 179.4,20.64 180.2,20.64 180.8,21.23 182.28,21.23 183.23,22.19 183.23,36.23 155.61,63.86 80.86,63.86 80.42,63.42 77.05,63.42 76.62,63.86 72.73,63.86 69.44,67.14 69.44,74.93 69.03,75.34 69.03,76.54 69.39,76.89 69.39,79.08 62.16,86.31 62.04,86.31 55.79,92.56 55.79,93.9 54.22,95.47 48.43,95.47 47.38,96.52 R3.1
N$303
  Top 0.203: IC1.13 IC1.14 182,20.02 182.79,20.02 184.45,21.68 184.45,36.74 156.12,65.08 80.35,65.08 79.92,64.64 77.56,64.64 77.12,65.08 73.76,65.08 72.03,66.81 72.03,68.16 72.39,68.51 72.39,82.77 72.48,82.86 72.48,89.17 68.71,92.94 68.71,93.72 66.96,95.47 63.67,95.47 62.62,96.52 R4.1
N$304
  Top 0.203: IC2.2 IC2.1 186.62,20.02 186.53,20.02 184.86,21.68 184.86,36.91 156.28,65.48 80.19,65.48 79.75,65.04 77.73,65.04 77.29,65.48 73.93,65.48 72.44,66.98 72.44,67.99 72.79,68.34 72.79,79.03 76.43,82.66 76.43,91.91 77.79,93.27 R5.1
N$305  (via drill 0.51)
  Top 0.203: IC2.7 IC2.6 188.57,13.05 189.13,13.05 190.12,14.04 190.12,19.5 188.98,20.64 188.14,20.64 187.54,21.23 187.03,21.23 186.08,22.19 186.08,37.41 156.79,66.7 79.68,66.7 79.24,66.26 78.23,66.26 75.38,69.11 75.38,76.66 77.52,78.79 77.52,79.25 84.67,86.4 85.13,86.4 v88.9,90.17 | v91.44,96.52 R6.1
  Bottom 0.203: v88.9,90.17 88.9,93.98 v91.44,96.52
N$306  (via drill 0.51)
  Top 0.203: IC2.8 IC2.9 192.43,13.05 191.87,13.05 190.52,14.4 190.52,19.66 189.15,21.04 188.3,21.04 187.71,21.64 187.2,21.64 186.48,22.36 186.48,37.58 156.96,67.11 79.51,67.11 79.07,66.67 78.4,66.67 77.92,67.14 77.92,76.66 80.07,78.8 80.07,79.19 84.6,83.72 84.6,84.15 85.63,85.18 87.27,85.18 88.25,86.17 103.95,86.17 v105.41,87.63 | v105.41,96.52 R7.1
  Bottom 0.203: v105.41,87.63 105.41,91.72 104.19,92.94 104.19,95.2 104.14,95.25 v105.41,96.52
N$307  (via drill 0.51)
  Top 0.203: IC2.13 IC2.14 191.77,20.07 191.77,20.2 189.71,22.26 188.81,22.26 188.21,22.86 187.7,22.86 187.7,38.1 178.95,46.86 178.93,46.86 157.46,68.33 81.82,68.33 80.46,69.69 80.46,72.85 80.82,73.2 80.82,75.29 81.23,75.69 81.23,77.42 85.47,81.66 87.09,81.66 90.21,84.78 110.54,84.78 110.91,84.4 114.88,84.4 v120.65,90.17 | v121.92,96.52 R8.1
  Bottom 0.203: v120.65,90.17 120.65,91.72 119.43,92.94 119.43,93.93 119.38,93.98 v121.92,96.52
N$308
  Top 0.203: IC3.2 IC3.1 200.28,29.14 199.64,29.78 199.64,44.47 189.48,54.62 189.48,58.32 168.43,79.38 145.17,79.38 137.8,86.75 137.8,95.56 R9.1
N$309
  Top 0.203: IC3.7 IC3.6 200.95,13.05 201.51,13.05 202.5,14.04 202.5,19.3 205.05,21.85 205.18,21.85 206.1,22.77 206.1,25.05 200.86,30.28 200.86,44.97 190.7,55.13 190.7,61.74 185.37,67.08 185.37,70.53 185.01,70.88 185.01,78.57 184.96,78.62 184.96,78.91 184.48,79.38 184.2,79.38 182.18,81.41 169.1,81.41 R10.1
N$310
  Top 0.203: R11.1 168.28,95.56 168.28,86.75 171.21,83.82 176.28,83.82 177.24,84.78 179.38,84.78 184.37,79.79 184.65,79.79 185.37,79.07 185.37,78.79 185.42,78.74 185.42,71.05 185.77,70.69 185.77,67.25 191.11,61.91 191.11,55.3 201.27,45.14 201.27,30.45 206.5,25.21 206.5,22.6 205.35,21.45 205.22,21.45 203.26,19.5 203.26,14.04 204.26,13.05 204.82,13.05 IC3.9 IC3.8
N$311
  Top 0.203: R12.1 190.45,90.54 190.45,69.52 190.14,69.21 190.14,65.83 192.33,63.64 192.33,55.8 202.49,45.64 202.49,30.95 207.72,25.72 207.72,20.97 IC3.14 IC3.13
N$312
  Top 0.203: IC4.2 IC4.1 209.45,22.26 209.05,22.26 208.37,22.94 208.37,25.64 202.89,31.12 202.89,45.81 192.73,55.97 192.73,64.05 190.55,66.23 190.55,69.04 190.85,69.35 190.85,85.84 199.71,94.7 R13.1
N$313  (via drill 0.51)
  Top 0.203: IC4.7 IC4.6 213.65,13.05 214.21,13.05 215.2,14.04 215.2,20.54 204.11,31.63 204.11,46.32 193.95,56.48 193.95,67.67 193.49,68.12 193.49,76.61 195.12,78.23 195.12,78.57 195.22,78.67 195.22,79.24 201.12,85.14 203.7,85.14 207.46,88.9 v210.82,88.9 | v213.36,95.25 214.63,96.52 R14.1
  Bottom 0.203: v210.82,88.9 214.63,92.71 214.63,93.98 v213.36,95.25
N$315
  Top 0.203: IC4.13 IC4.14 216.83,20.09 216.83,21.59 205.74,32.68 205.74,46.99 195.58,57.15 195.58,64.49 198.57,67.48 198.57,70.36 209.47,81.25 240.24,81.25 247.19,88.2 247.19,93.49 R16.1
S0  (via drill 0.51)
  Top 0.203: IC9.10 71.12,6.15 v71.12,5.08 | v25.4,7.62 IC10.8
  Bottom 0.203: v71.12,5.08 69.84,3.8 67.31,3.8 66.32,4.8 63.16,4.8 62.17,3.81 60.96,3.81 54.53,10.24 29.21,10.24 26.59,7.62 v25.4,7.62
S1  (via drill 0.51)
  Top 0.203: IC9.11 72.36,7.45 72.36,8.97 69.9,11.43 67.26,11.43 v66.93,11.76 | v24.13,8.89 22.86,7.62 IC10.7
  Bottom 0.203: v66.93,11.76 62.55,11.76 61.44,10.65 28.88,10.65 27.12,8.89 v24.13,8.89
S2  (via drill 0.51)
  Top 0.203: IC9.14 73.03,14.61 72.39,13.97 v72.41,13.94 | v20.32,12.7 IC10.6
  Bottom 0.203: v72.41,13.94 70.85,13.94 70.82,13.98 70.01,13.98 69.55,13.52 66.1,13.52 64.47,15.14 63.56,15.14 61.93,13.52 21.14,13.52 v20.32,12.7
S3  (via drill 0.51)
  Top 0.203: IC9.13 74.3,13.34 v73.66,12.7 | v17.78,10.16 17.78,2.54 IC10.5
  Bottom 0.203: v73.66,12.7 71.17,12.7 70.82,12.35 67.49,12.35 67.27,12.57 66.6,12.57 66.38,12.35 61.76,12.35 60.46,11.05 28.71,11.05 27.82,10.16 v17.78,10.16
S$2
  Top 0.203: IC8.12 155.96,14.29 R65.2 R66.2
SCL  (via drill 0.51)
  Top 0.203: 236.86,19.05 236.86,18.75 D3.C 239.4,14.61 238.13,13.34 238.13,4.44 JP1.P$2_SWITCH | 236.86,19.05 D2.A 236.86,26.04 I2C.2 | 236.86,19.05 236.54,18.73 R49.1 234,19.05 v232.41,19.05
  Bottom 0.203: IC10.19/A5 21.32,18.41 22.81,19.91 36.18,19.91 36.59,19.51 65.05,19.51 66.22,20.68 88.66,20.68 89.83,19.51 95.58,19.51 95.84,19.76 108.02,19.76 110.82,16.97 126.88,16.97 128.1,18.19 157.19,18.19 158.41,16.97 171.33,16.97 172.55,18.19 231.54,18.19 v232.41,19.05
SDA  (via drill 0.51)
  Top 0.203: JP1.P$1_TIP 241.94,13.57 D4.C 244.48,18.75 D5.A 245.1,18.73 R50.1 247.65,19.36 v247.65,20.32
  Bottom 0.203: IC10.18/A4 23.86,18.41 24.95,19.51 36.01,19.51 36.47,19.05 65.16,19.05 66.39,20.27 88.49,20.27 89.66,19.1 95.75,19.1 96.01,19.36 107.86,19.36 110.7,16.51 127,16.51 128.22,17.73 157.07,17.73 158.29,16.51 171.45,16.51 172.72,17.78 245.11,17.78 v247.65,20.32 244.55,23.42 244.55,36 246.38,37.83 I2C.1
W0  (via drill 0.51)
  Top 0.203: R69.1 89.61,8.57 90.97,7.21 99.23,7.21 99.46,7.45 99.46,12.69 99.27,12.88 99.27,16.33 99.46,16.52 99.46,20.5 97.96,22 91.03,22 v90.17,22.86 | v21.59,90.17 20,90.17 R17.2
  Bottom 0.203: U$1.2 14.75,92.58 18.92,92.58 20.55,90.95 20.81,90.95 v21.59,90.17 31.75,80.01 120.65,80.01 133.44,67.22 133.44,30.67 129.44,26.67 127,26.67 123.19,22.86 119.77,22.86 118.93,22.02 110.39,22.02 110.06,22.35 108.38,22.35 108.28,22.26 94.44,22.26 93.84,22.86 v90.17,22.86
W1  (via drill 0.51)
  Top 0.203: v90.17,20.32 90.17,17.14 R53.1 | v36.83,90.17 35.24,90.17 R18.2
  Bottom 0.203: U$2.2 29.15,92.77 31.75,90.17 v36.83,90.17 46.58,80.42 120.82,80.42 133.84,67.39 133.84,30.5 129.6,26.26 127.68,26.26 123.88,22.45 119.94,22.45 119.1,21.61 110.22,21.61 109.89,21.95 108.54,21.95 108.29,21.69 91.54,21.69 v90.17,20.32
W2  (via drill 0.51)
  Top 0.203: R71.1 95.89,7.62 98.87,7.62 98.87,20.52 97.87,21.51 93.9,21.51 v92.71,20.32 | v53.34,90.17 50.48,90.17 R19.2
  Bottom 0.203: U$3.2 44.25,93.47 48.5,93.47 51.03,90.95 52.56,90.95 v53.34,90.17 62.68,80.82 120.98,80.82 134.25,67.56 134.25,30.33 129.77,25.85 127.85,25.85 124.05,22.05 120.14,22.05 119.3,21.21 110.05,21.21 109.72,21.54 108.71,21.54 108.46,21.29 93.67,21.29 v92.71,20.32
W3  (via drill 0.51)
  Top 0.203: R55.1 94.93,20 v95.25,20.32 | v67.31,90.17 65.72,90.17 R20.2
  Bottom 0.203: U$4.2 60.47,92.58 64.64,92.58 66.27,90.95 66.53,90.95 v67.31,90.17 76.25,81.23 121.27,81.23 134.65,67.85 134.65,29.95 129.49,24.79 129.49,22.94 128.19,21.64 120.48,21.64 119.64,20.8 109.88,20.8 109.55,21.13 108.88,21.13 108.07,20.32 v95.25,20.32
W4  (via drill 0.51)
  Top 0.203: R21.2 80.33,90.81 v83.18,90.81 | v113.03,19.05 115.57,21.59 121.92,21.59 124.46,19.05 124.46,13.74 124.89,13.3 127.53,13.3 127.71,13.13 127.71,12.27 127.53,12.1 124.89,12.1 124,11.21 124,6.01 123.07,5.08 115.57,5.08 R73.1
  Bottom 0.203: v113.03,19.05 113.72,19.05 115.07,20.4 119.81,20.4 120.65,21.23 128.36,21.23 129.9,22.77 129.9,23.67 135.06,28.84 135.06,68.02 121.44,81.64 92.35,81.64 v83.18,90.81 77.49,90.81 U$5.2
W5  (via drill 0.51)
  Top 0.203: R57.1 112.08,16.83 v113.03,17.78 | R22.2 96.71,89.66 v97.28,89.66
  Bottom 0.203: v113.03,17.78 115.24,19.99 120.32,19.99 121.16,20.83 128.53,20.83 130.3,22.6 130.3,23.5 135.47,28.67 135.47,68.18 121.61,82.04 104.9,82.04 v97.28,89.66 93.52,93.42 U$6.2
W6  (via drill 0.51)
  Top 0.203: R23.2 111.44,90.17 v114.3,90.17 | v121.92,19.05 121.07,18.2 121.07,7.8 120.89,7.62 119.14,7.62 118.18,8.57 R75.1
  Bottom 0.203: U$7.2 108.51,93.42 111.76,90.17 v114.3,90.17 135.87,68.59 135.87,28.5 130.71,23.34 130.71,22.43 128.7,20.42 121.44,20.42 120.38,19.36 119.04,19.36 118.56,18.88 118.56,18.2 119.04,17.73 120.6,17.73 v121.92,19.05
W7  (via drill 0.51)
  Top 0.203: R59.1 117.79,17.21 119.12,18.54 v119.38,18.54 | R24.2 126.56,90.3 v127.12,90.3
  Bottom 0.203: U$8.2 124,93.42 v127.12,90.3 135.07,82.34 135.07,82.21 136.28,81.01 136.28,28.33 131.12,23.17 131.12,22.27 128.71,19.86 121.58,19.86 120.26,18.54 v119.38,18.54
W8  (via drill 0.51)
  Top 0.203: v143.51,90.17 141.92,90.17 R25.2 | R77.1 135.33,8.57 136.69,7.21 143.92,7.21 144.78,8.07 144.78,20.32 143.51,21.59 133.35,21.59 v130.81,19.05
  Bottom 0.203: v130.81,19.05 136.69,24.93 136.69,73.64 143.51,80.46 v143.51,90.17 140.26,93.42 U$9.2
W9  (via drill 0.51)
  Top 0.203: R61.1 134.62,16.51 v134.62,20.32 | R26.2 157.16,90.17 v157.48,90.17
  Bottom 0.203: U$10.2 151.05,93.42 151.6,93.98 153.67,93.98 v157.48,90.17 149.37,82.06 145.92,82.06 142.14,78.28 141.9,78.28 137.09,73.47 137.09,22.8 v134.62,20.32
W10  (via drill 0.51)
  Top 0.203: R79.1 140.65,8.89 140.73,8.89 142,7.62 143.75,7.62 143.93,7.8 143.93,16.97 140.7,20.19 v140.59,20.19 | v170.18,93.98 171.13,93.03 R27.2 173.67,88.9 v173.99,88.9
  Bottom 0.203: v170.18,93.98 169.62,93.42 U$11.2 | v173.99,88.9 166.34,81.25 146.26,81.25 142.48,77.47 142.24,77.47 138.02,73.25 138.02,22.76 v140.59,20.19
W11  (via drill 0.51)
  Top 0.203: v189.23,90.17 187.64,90.17 R28.2 | R63.1 138.43,18.41 v138.43,20.32
  Bottom 0.203: v189.23,90.17 184.8,90.17 U$12.2 179.48,91.35 175.29,91.35 165.6,81.66 146.09,81.66 142.31,77.88 142.07,77.88 137.5,73.31 137.5,21.25 v138.43,20.32
W12  (via drill 0.51)
  Top 0.203: v204.47,90.17 202.88,90.17 R29.2 | v156.21,19.05 160.14,19.05 161.36,20.27 165.6,20.27 168.47,17.41 168.47,3.81 159.07,3.81 R81.1
  Bottom 0.203: v156.21,19.05 154.89,20.37 143,20.37 138.43,24.95 138.43,73.08 142.41,77.06 142.65,77.06 146.43,80.84 195.14,80.84 v204.47,90.17 200.04,90.17 U$13.2
W13  (via drill 0.51)
  Top 0.203: v158.75,17.78 158.75,16.51 R65.1 | R30.2 214.87,93.42 U$14.2
  Bottom 0.203: v158.75,17.78 155.75,20.78 143.17,20.78 138.88,25.06 138.88,72.73 146.6,80.44 199.05,80.44 U$14.2
W14  (via drill 0.51)
  Top 0.203: v231.14,93.98 231.14,92.39 R31.2 | v161.29,19.05 163.95,19.05 164.76,19.86 165.43,19.86 168.06,17.24 168.06,6.77 166.37,5.08 164.78,6.67 R67.1
  Bottom 0.203: v161.29,19.05 158.9,19.05 156.77,21.18 143.34,21.18 139.29,25.23 139.29,72.56 146.77,80.03 213.88,80.03 U$15.2 227.83,93.98 v231.14,93.98
W15  (via drill 0.51)
  Top 0.203: v165.1,19.05 164.78,18.73 R51.1 | R32.2 245.11,90.17 v246.38,91.44
  Bottom 0.203: v165.1,19.05 162.56,21.59 143.51,21.59 139.7,25.4 139.7,72.39 146.93,79.63 225.82,79.63 231.67,85.47 234.56,85.47 U$16.2 244.49,91.44 v246.38,91.44

## Text on the board
tPlace: MIDI | I2C
bPlace: 9 | 10 | 11 | 12 | 13 | 14 | 15 | 16 | Arthur Gibert AKA AtoVproject | ALPS Faders | Inspired by the / Berlin Modular community | MIDI MODE | USB | Eurorack | Power Mode
tNames: 74HC4067 | Teensy 3.2 | USB | Stereo / Jack | Stereo / Jack
bNames: 4 | 6 | 7 | 8 | 1 | 2 | 3 | 5 | 5V | 5V | 16 | GND | 10V | 10V | GND | Sean Hellfritsch / Brian Crabtree / Tom Armitage / Brendon Cassidy | Reworked | By: | CC-BY-SA 4.0 | Creative Commons / Attribution / ShareAlike | SDA | V1.4 | SCL | GND | I2C: Tip SDA, Ring SCL / DO NOT HOT PLUG